# EAGLE design Bpod_Serial_Shield_r1 (EAGLE 6.3)
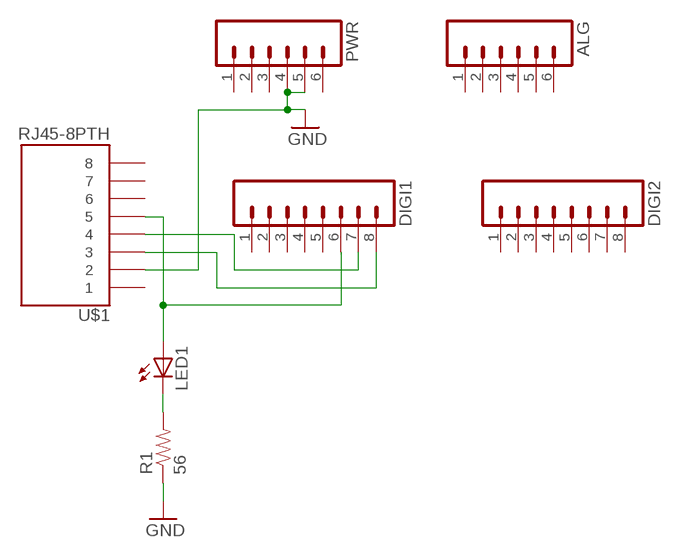
[diagram p0: schematic, sheet 1]

## Parts
ALG  M06LONGPADS  [1X06_LONGPADS]
DIGI1  M08LONGPADS  [1X08_LONGPADS]
DIGI2  M08LONGPADS  [1X08_LONGPADS]
LED1  LED3MM  [LED3MM]
PWR  M06LONGPADS  [1X06_LONGPADS]
R1  56  RESISTORAXIAL-0.3  [AXIAL-0.3]
U$1  RJ45-8PTH  [RJ45-8]

## Nets
GND: PWR.4 PWR.5 R1.P$1 U$1.2
N$1: DIGI1.8 U$1.3
N$2: DIGI1.7 U$1.4
N$4: DIGI1.6 LED1.A U$1.5
N$5: LED1.K(C) R1.P$2
Unconnected: ALG.1 ALG.2 ALG.3 ALG.4 ALG.5 ALG.6 DIGI1.1 DIGI1.2 DIGI1.3 DIGI1.4 DIGI1.5 DIGI2.1 DIGI2.2 DIGI2.3 DIGI2.4 DIGI2.5 DIGI2.6 DIGI2.7 DIGI2.8 PWR.1 PWR.2 PWR.3 PWR.6 U$1.1 U$1.6 U$1.7 U$1.8

## Library data of the parts
ALG PWR = SparkFun:M06: Header 6 Standard 6-pin 0.1" header. Use with straight break away headers (SKU : PRT-00116), right angle break away headers (PRT-00553), swiss pins (PRT-00743), machine pins (PRT-00117), and female headers (PRT-00115). Molex polarized connector foot print use with SKU : PRT-08094 with associated crimp pins and housings. NOTES ON THE VARIANTS LOCK and LOCK_LONGPADS... This footprint was designed to help hold the alignment of a through-hole component (i.e. 6-pin header) while soldering it into place. You may notice that each hole has been shifted either up or down by 0.005 of an inch from it's more standard position (which is a perfectly straight line). This slight alteration caused the pins (the squares in the middle) to touch the edges of the holes. Because they are alternating, it causes a "brace" to hold the component in place. 0.005 has proven to be the perfect amount of "off-center" position when using our standard breakaway headers. Although looks a little odd when you look at the bare footprint, once you have a header in there, the alteration is very hard to notice. Also, if you push a header all the way into place, it is covered up entirely on the bottom side. This idea of altering the position of holes to aid alignment will be further integrated into the Sparkfun Library for other footprints. It can help hold any component with 3 or more connection pins.
DIGI1 DIGI2 = SparkFun:M08: Header 8 Standard 8-pin 0.1" header. Use with straight break away headers (SKU : PRT-00116), right angle break away headers (PRT-00553), swiss pins (PRT-00743), machine pins (PRT-00117), and female headers (PRT-00115).
LED1 = led:LED: LED OSRAM: - CHIPLED LG R971, LG N971, LY N971, LG Q971, LY Q971, LO R971, LY R971 LH N974, LH R974 LS Q976, LO Q976, LY Q976 LO Q996 - Hyper CHIPLED LW Q18S LB Q993, LB Q99A, LB R99A - SideLED LS A670, LO A670, LY A670, LG A670, LP A670 LB A673, LV A673, LT A673, LW A673 LH A674 LY A675 LS A676, LA A676, LO A676, LY A676, LW A676 LS A679, LY A679, LG A679 - Hyper Micro SIDELED® LS Y876, LA Y876, LO Y876, LY Y876 LT Y87S - SmartLED LW L88C, LW L88S LB L89C, LB L89S, LG L890 LS L89K, LO L89K, LY L89K LS L896, LA L896, LO L896, LY L896 - TOPLED LS T670, LO T670, LY T670, LG T670, LP T670 LSG T670, LSP T670, LSY T670, LOP T670, LYG T670 LG T671, LOG T671, LSG T671 LB T673, LV T673, LT T673, LW T673 LH T674 LS T676, LA T676, LO T676, LY T676, LB T676, LH T676, LSB T676, LW T676 LB T67C, LV T67C, LT T67C, LS T67K, LO T67K, LY T67K, LW E67C LS E67B, LA E67B, LO E67B, LY E67B, LB E67C, LV E67C, LT E67C LW T67C LS T679, LY T679, LG T679 LS T770, LO T770, LY T770, LG T770, LP T770 LB T773, LV T773, LT T773, LW T773 LH T774 LS E675, LA E675, LY E675, LS T675 LS T776, LA T776, LO T776, LY T776, LB T776 LHGB T686 LT T68C, LB T68C - Hyper Mini TOPLED® LB M676 - Mini TOPLED Santana® LG M470 LS M47K, LO M47K, LY M47K Source: http://www.osram.convergy.de LUXEON: - LUMILED® LXK2-PW12-R00, LXK2-PW12-S00, LXK2-PW14-U00, LXK2-PW14-V00 LXK2-PM12-R00, LXK2-PM12-S00, LXK2-PM14-U00 LXK2-PE12-Q00, LXK2-PE12-R00, LXK2-PE12-S00, LXK2-PE14-T00, LXK2-PE14-U00 LXK2-PB12-K00, LXK2-PB12-L00, LXK2-PB12-M00, LXK2-PB14-N00, LXK2-PB14-P00, LXK2-PB14-Q00 LXK2-PR12-L00, LXK2-PR12-M00, LXK2-PR14-Q00, LXK2-PR14-R00 LXK2-PD12-Q00, LXK2-PD12-R00, LXK2-PD12-S00 LXK2-PH12-R00, LXK2-PH12-S00 LXK2-PL12-P00, LXK2-PL12-Q00, LXK2-PL12-R00 Source: www.luxeon.com KINGBRIGHT: KA-3528ASYC Source: www.kingbright.com
R1 = SparkFun:RESISTOR: Resistor Basic schematic elements and footprints for 0603, 1206, and PTH resistors.
U$1 = SparkFun:RJ45-8: RJ45 Jack Simple RJ45, 8-pin connection - connector for common Cat5, Cat5e, and Cat6 Ethernet cables. Footprint not yet proven in production. Connector sku is PRT-00643; Breakout PCB sku is BOB-00716.

## Board
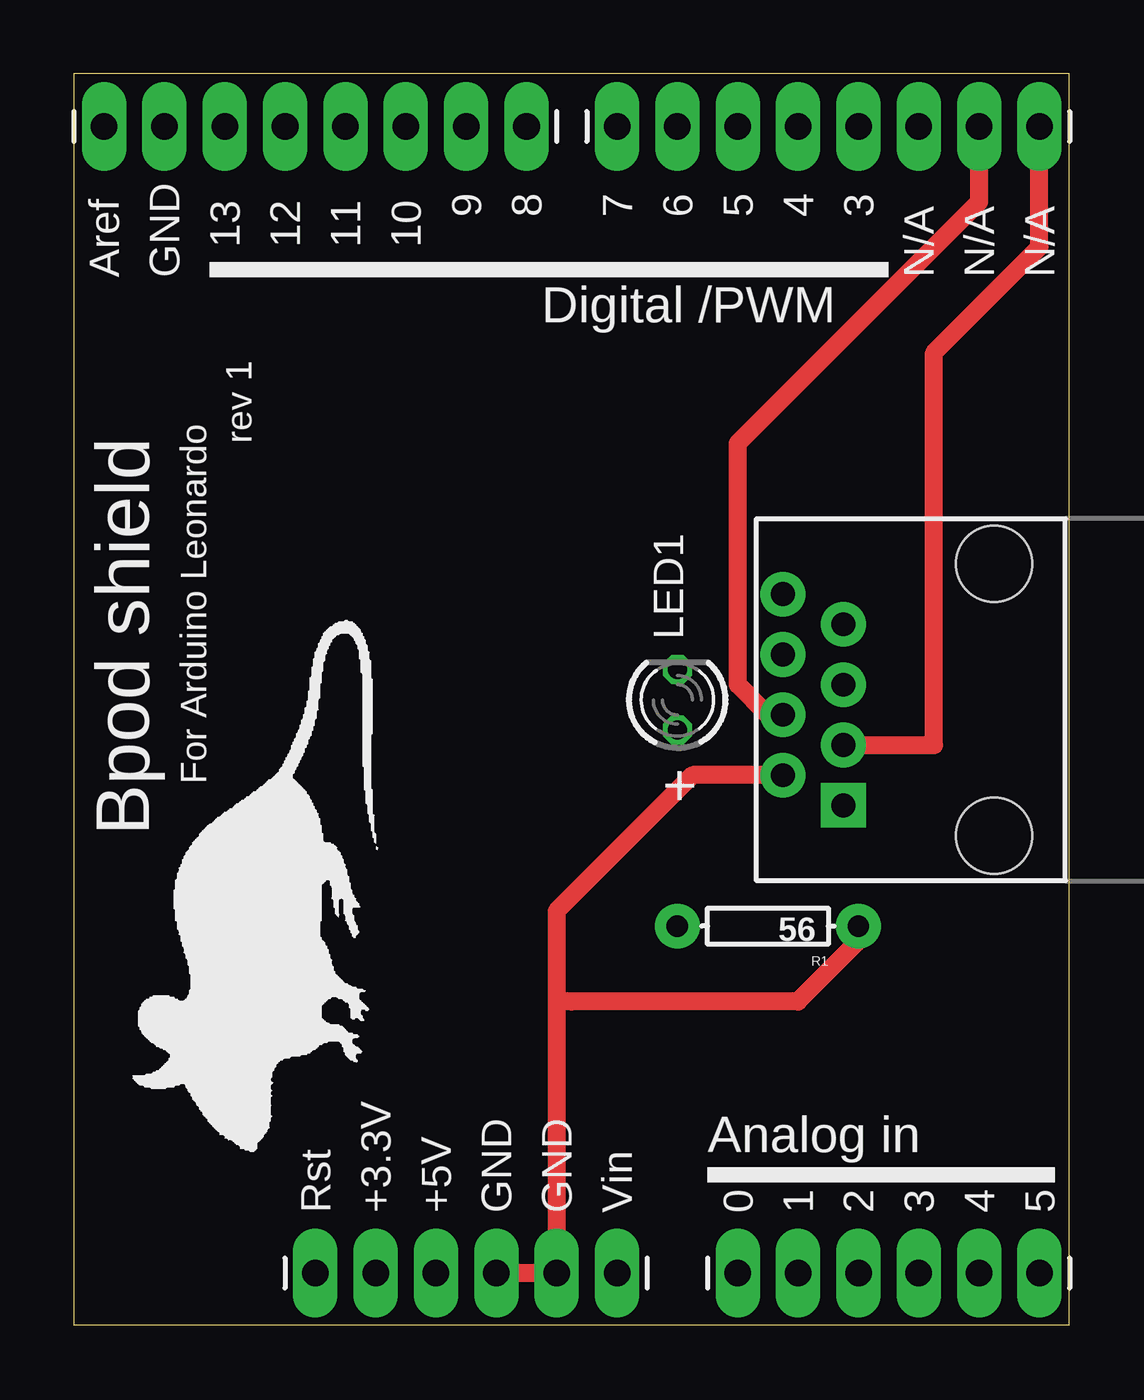
[diagram p1: board, top side]
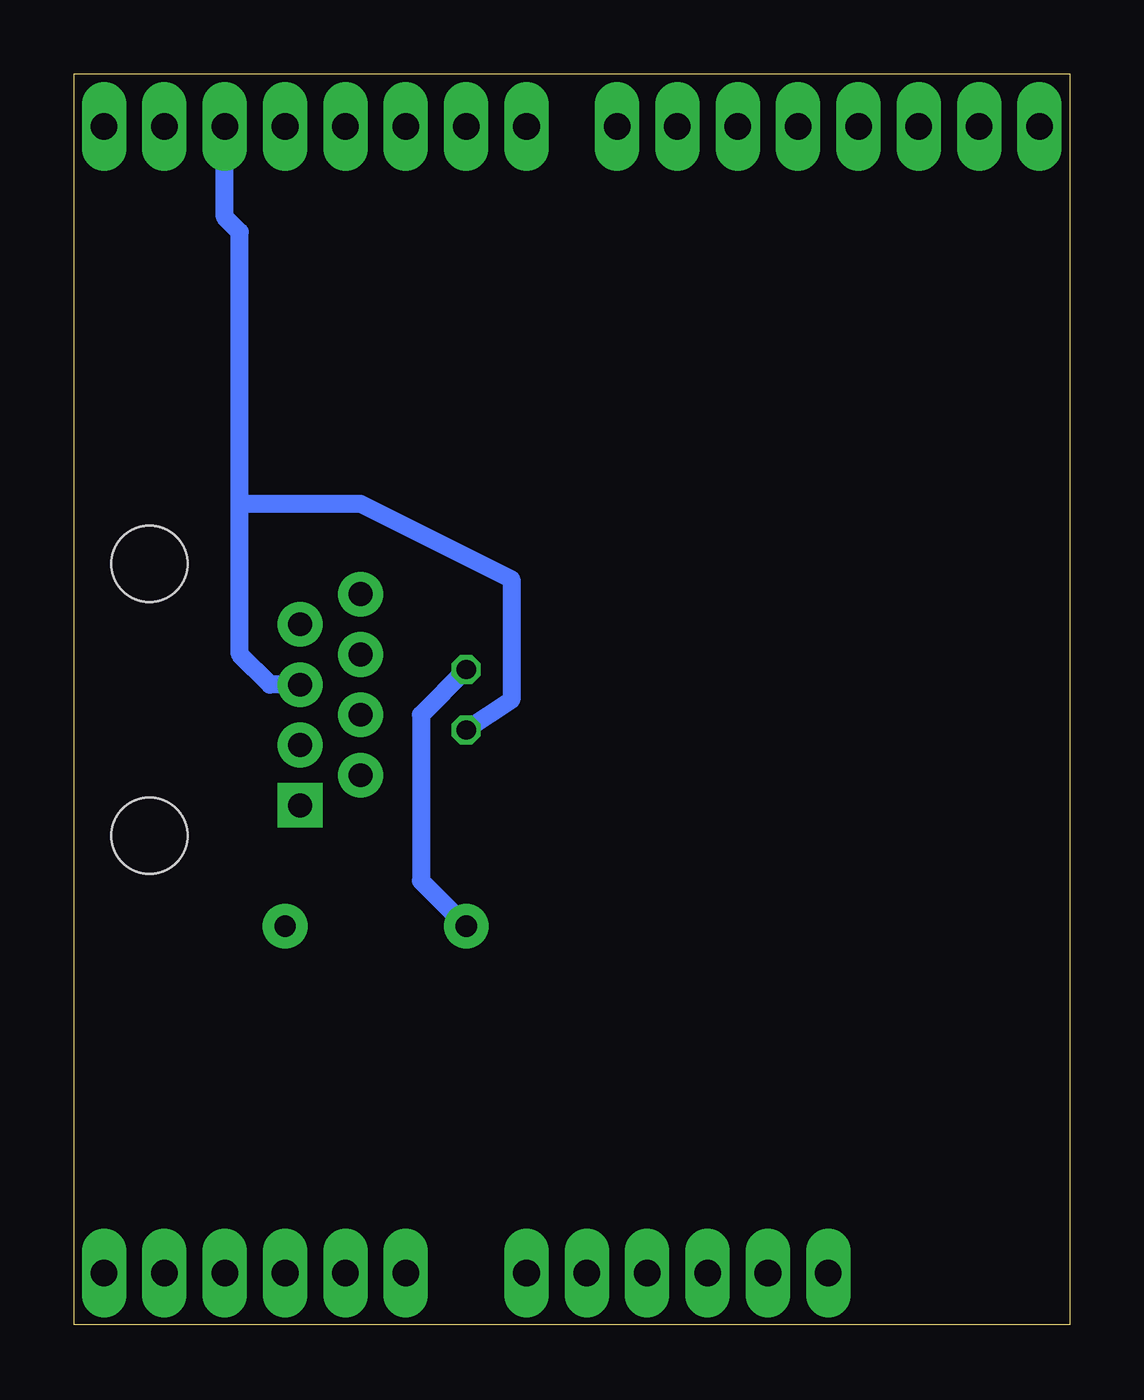
[diagram p2: board, bottom side, seen from below]

Size 41.89 x 52.64 mm. Coordinates in mm from the lower left corner, seen from the top.
Outline: 0,0 41.89,0 41.89,52.64 0,52.64 0,0
Copper layers (1*2*15*16): Top 0.035mm / dielectric 0.2mm / Route2 0.0175mm / dielectric 1.1mm / Route15 0.0175mm / dielectric 0.2mm / Bottom 0.035mm
Design rules "SeeedStudio_DRU_no_angle_20130527": minimum track width 6mil, minimum drill 12mil, track to track 6mil, track to pad 6mil, pad to pad 6mil, via to via 6mil, smd to smd 0mil, copper to edge 10mil, drill to drill 10mil, minimum pad ring 6mil, minimum via ring 6mil, stop-mask expansion 2mil, vias tented up to drill 25mil, thermal gap 10mil

### Footprints (pad centres in the part's own frame; a part is rotated, then mirrored left to right if it is on the bottom)
1X06_LONGPADS = drill 1.118 pad 1.88 long: 1 0,0; 2 2.54,0; 3 5.08,0; 4 7.62,0; 5 10.16,0; 6 12.7,0
1X08_LONGPADS = drill 1.118 pad 1.88 long: 1 0,0; 2 2.54,0; 3 5.08,0; 4 7.62,0; 5 10.16,0; 6 12.7,0; 7 15.24,0; 8 17.78,0
LED3MM = drill 0.813 octagon: A -1.27,0; K 1.27,0
AXIAL-0.3 = drill 0.9 pad 1.88: P$1 -3.81,0; P$2 3.81,0
RJ45-8 = drill 1 pad 1.88 square: 1 -4.445,6.35 | drill 1 pad 1.88: 2 -3.175,8.89; 3 -1.905,6.35; 4 -0.635,8.89; 5 0.635,6.35; 6 1.905,8.89; 7 3.175,6.35; 8 4.445,8.89 | hole 3.2: -5.715,0; 5.715,0

### Placement (x,y rotation side)
ALG  27.94,2.17 0 top
DIGI1  22.86,50.43 0 top
DIGI2  1.27,50.43 0 top
LED1  25.4,26.3 90 top
PWR  10.16,2.17 0 top
R1  29.21,16.77 180 top
U$1  38.73,26.3 90 top
U$2  [MOUSELOGO]  0.64,5.35 0 top

### Tracks (layer width: path | path; a pad name or v marks a point on that pad's centre or on a via)
GND
  Top 0.762: U$1.2 26.04,23.12 20.32,17.41 20.32,13.6 | 20.32,13.6 PWR.5 PWR.4 | R1.P$1 33.02,16.14 30.48,13.6 20.95,13.6 20.32,13.6
N$1
  Top 0.762: U$1.3 36.2,24.39 36.2,40.91 40.64,45.35 DIGI1.8
N$2
  Top 0.762: U$1.4 29.21,25.66 27.94,26.93 27.94,37.09 38.1,47.25 DIGI1.7
N$4
  Bottom 0.762: U$1.5 33.66,26.93 34.92,28.2 34.92,34.55 | 34.92,34.55 29.84,34.55 23.5,31.38 23.5,26.3 LED1.A | 34.92,34.55 34.92,45.98 35.56,46.62 DIGI1.6
N$5
  Bottom 0.762: LED1.K 27.3,25.66 27.3,18.68 R1.P$2

### Text on the board
tPlace: 9 | 8 | 7 | 6 | 5 | 4 | 3 | 13 | 12 | 11 | 10 | Aref | GND | N/A | N/A | N/A | Digital /PWM | rev 1 | For Arduino Leonardo | + | Bpod shield | Analog in | Rst | +3.3V | +5V | GND | GND | Vin | 0 | 1 | 2 | 3 | 4 | 5